# EAGLE design Aeolus_SMA_inc_sensor (EAGLE 7.7.0)
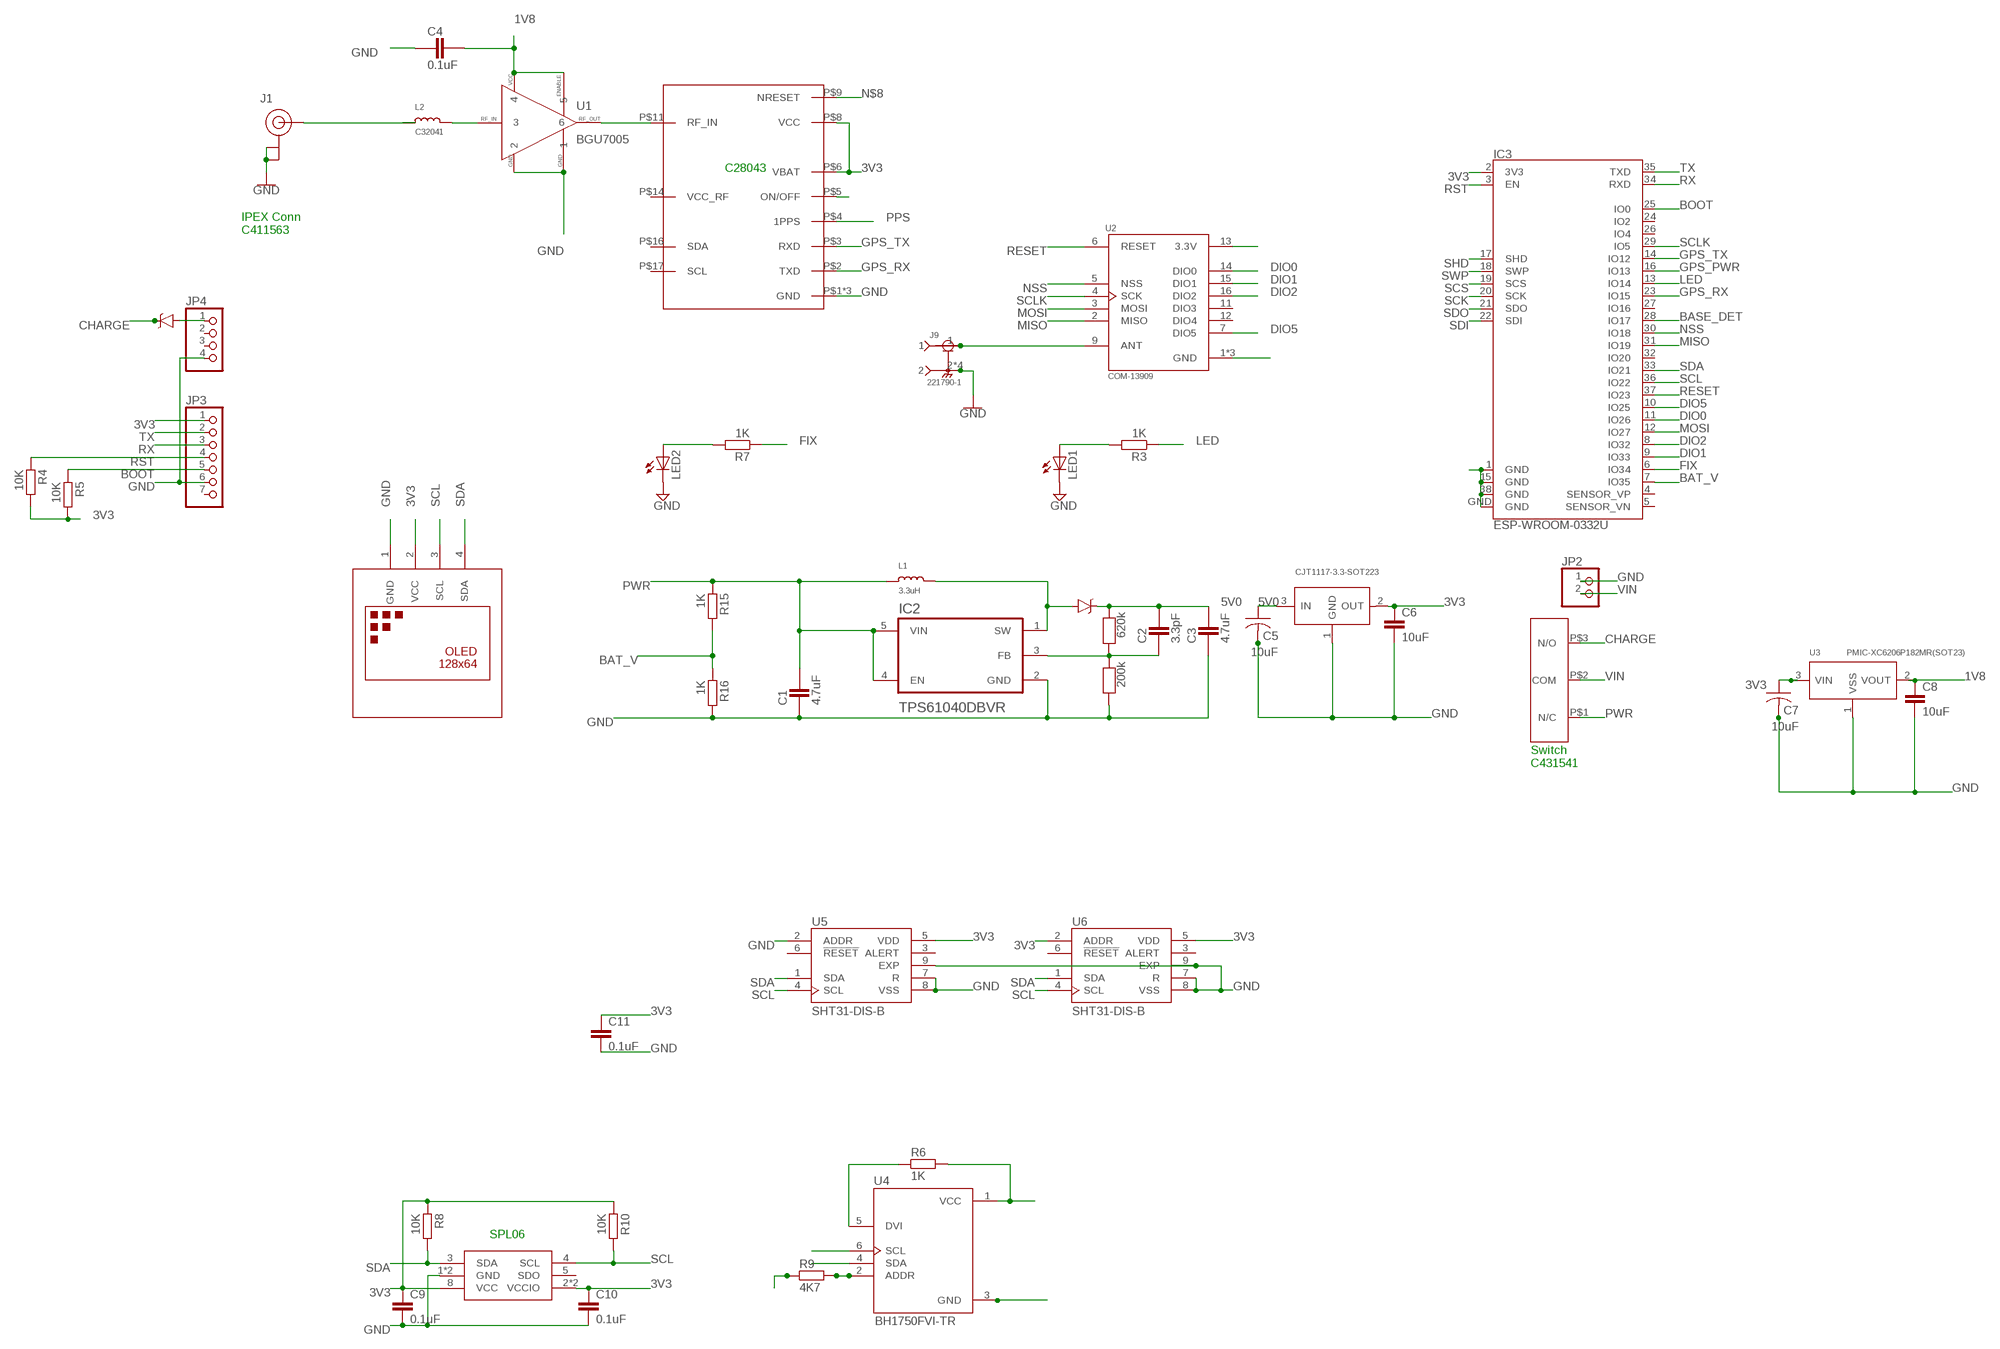
[diagram p0: schematic, sheet 1]

## Parts
C1  4.7uF  CAPACITOR_0603  [CAPC1608X92N]
C2  3.3pF  CAPACITOR_0402  [CAPC1005X60N]
C3  4.7uF  CAPACITOR_0603  [CAPC1608X92N]
C4  0.1uF  CAPACITOR_0603  [CAPC1608X92N]
C5  10uF  C-USC0805  [C0805]
C6  10uF  C-EUC0805  [C0805@1]
C7  10uF  C-USC0402  [C0402]
C8  10uF  C-EUC0402K  [C0402K@1]
C9  0.1uF  C-EUC0603  [C0603@1]
C10  0.1uF  C-EUC0603  [C0603@1]
C11  0.1uF  C-EUC0603  [C0603@1]
D1  BA340A  B340A  [SMA-DIODE]
D2  BA340A  B340A  [SMA-DIODE]
IC1  CJT1117-3.3-SOT223  PMIC-CJT1117-3.3(SOT223)  [SOT-223]
IC2  TPS61040DBVR  [SOT95P280X145-5N]
IC3  ESP-WROOM-0332U  [ESP32-WROOM-32U]
IC54  ATGM336H  [ATGM336H]
J1  U.FL  [U.FL]
J9  221790-1  [TE_221790-1]
JP2  HEADER-1X2ROUND  [1X02_ROUND]
JP3  HEADER-1X7ROUND  [1X07_ROUND]
JP4  HEADER-1X4ROUND  [1X04_ROUND]
L1  3.3uH  INDUCTORNR5040  [INDUCTOR_5X5MM_NR5040_NOTHERMALS]
L2  C32041  INDUCTOR_0402  [_0402]
LED1  LEDSML0805  [SML0805]
LED2  LEDSML0805  [SML0805]
R1  620k  RESISTOR0603  [0603]
R2  200k  RESISTOR0603  [0603]
R3  1K  RESISTOR_0603  [RESC1608X55N]
R4  10K  RESISTOR_0603  [RESC1608X55N]
R5  10K  RESISTOR_0603  [RESC1608X55N]
R6  1K  RESISTOR_0603  [RESC1608X55N]
R7  1K  RESISTOR_0603  [RESC1608X55N]
R8  10K  RESISTOR_0603  [RESC1608X55N]
R9  4K7  RESISTOR_0603  [RESC1608X55N]
R10  10K  RESISTOR_0603  [RESC1608X55N]
R15  1K  RESISTOR_0603  [RESC1608X55N]
R16  1K  RESISTOR_0603  [RESC1608X55N]
S1  SMD-SWITCH  [SMD-SWITCH]
U1  BGU7005  [SOT886]
U2  COM-13909  [MOD_COM-13909]
U3  PMIC-XC6206P182MR(SOT23)  [SOT-23]
U4  BH1750FVI-TR  [XDCR_BH1750FVI-TR]
U5  SHT31-DIS-B  [SON50P250X250X100-9N]
U6  SHT31-DIS-B  [SON50P250X250X100-9N]
U$1  DISPLAY-OLED-128X64-I2C  [DISPLAY-OLED-128X64-I2C]
U$4  SPL06  [SPL06]

## Nets
1V8: C4.2 C8.1 U1.4 U1.5 U3.2(VOUT)
3V3: C6.1 C7.1 C9.1 C10.1 C11.1 IC1.2(OUT) IC3.2(3V3) IC54.P$6(VBAT) IC54.P$8(VCC) JP3.1 R4.2 R5.2 R6.2 R8.1 R10.1 U2.13(3.3V) U3.3(VIN) U4.1(VCC) U5.5(VDD) U6.2(ADDR) U6.5(VDD) U$1.2(VCC) U$4.2(VCCIO) U$4.6(VCCIO) U$4.8(VCC)
5V0: C2.2 C3.2 C5.1 D1.C IC1.3(IN) R1.1
ANT: J9.1 U2.9(ANT)
BASE_DET: IC3.28(IO17)
BAT_V: IC3.7(IO35) R15.2 R16.1
BOOT: IC3.25(IO0) JP3.5 R5.1
CHARGE: D2.C S1.P$3(N/O)
DIO0: IC3.11(IO26) U2.14(DIO0)
DIO1: IC3.9(IO33) U2.15(DIO1)
DIO2: IC3.8(IO32) U2.16(DIO2)
DIO5: IC3.10(IO25) U2.7(DIO5)
FB: C2.1 IC2.3(FB) R1.2 R2.1
FIX: IC3.6(IO34) R7.1
GND: C1.1 C3.1 C4.1 C5.2 C6.2 C7.2 C8.2 C9.2 C10.2 C11.2 IC1.1(GND) IC2.2(GND) IC3.1(GND) IC3.15(GND) IC3.38(GND) IC3.GND IC54.P$1(GND) IC54.P$10(GND) IC54.P$12(GND) J1.1(GND) J1.2(GND) J9.2 J9.3 J9.4 J9.5 JP2.1 JP3.6 JP4.4 LED1.C LED2.C R2.2 R9.1 R16.2 U1.1 U1.2 U2.1(GND) U2.8(GND) U2.10(GND) U3.1(VSS) U4.3(GND) U5.2(ADDR) U5.7(R) U5.8(VSS) U5.9(EXP) U6.7(R) U6.8(VSS) U6.9(EXP) U$1.1(GND) U$4.1(GND) U$4.7(GND)
GPS_PWR: IC3.16(IO13)
GPS_RX: IC3.23(IO15) IC54.P$2(TXD)
GPS_TX: IC3.14(IO12) IC54.P$3(RXD)
LED: IC3.13(IO14) R3.1
MISO: IC3.31(IO19) U2.2(MISO)
MOSI: IC3.12(IO27) U2.3(MOSI)
N$1: D1.A IC2.1(SW) L1.P$2
N$2: D2.A JP4.1
N$3: LED1.A R3.2
N$4: J1.FEED(SIGNAL) L2.1
N$5: LED2.A R7.2
N$6: IC54.P$11(RF_IN) U1.6
N$7: R6.1 U4.5(DVI)
N$8: IC54.P$9(NRESET)
N$9: IC54.P$5(ON/OFF)
N$11: L2.2 U1.3
N$12: R9.2 U4.2(ADDR)
NSS: IC3.30(IO18) U2.5(NSS)
PPS: IC54.P$4(1PPS)
PWR: C1.2 IC2.4(EN) IC2.5(VIN) L1.P$1 R15.1 S1.P$1(N/C)
RESET: IC3.37(IO23) U2.6(RESET)
RST: IC3.3(EN) JP3.4 R4.1
RX: IC3.34(RXD) JP3.3
SCK: IC3.20(SCK)
SCL: IC3.36(IO22) R10.2 U4.6(SCL) U5.4(SCL) U6.4(SCL) U$1.3(SCL) U$4.4(SCL)
SCLK: IC3.29(IO5) U2.4(SCK)
SCS: IC3.19(SCS)
SDA: IC3.33(IO21) R8.2 U4.4(SDA) U5.1(SDA) U6.1(SDA) U$1.4(SDA) U$4.3(SDA)
SDI: IC3.22(SDI)
SDO: IC3.21(SDO)
SHD: IC3.17(SHD)
SWP: IC3.18(SWP)
TX: IC3.35(TXD) JP3.2
VIN: JP2.2 S1.P$2(COM)
Unconnected: IC3.4(SENSOR_VP) IC3.5(SENSOR_VN) IC3.24(IO2) IC3.26(IO4) IC3.27(IO16) IC3.32(IO20) IC54.P$14(VCC_RF) IC54.P$16(SDA) IC54.P$17(SCL) JP3.7 JP4.2 JP4.3 U2.11(DIO3) U2.12(DIO4) U5.3(ALERT) U5.6(!RESET) U6.3(ALERT) U6.6(!RESET) U$4.5(SDO)

## Notes on the sheet
- C28043
- IPEX Conn
  C411563
- Switch
  C431541
- SPL06

## Library data of the parts
C1-C4 = ipc-7351-capacitor:CAPACITOR_
C5 C7 = resistor:C-US: CAPACITOR, American symbol
C6 C8-C11 = resistor:C-EU: CAPACITOR, European symbol
D1 D2 = SparkFun-DiscreteSemi (Jaret’s MacBook Pro's conflicted copy 2016-01-31):B340A: Schottky Diode 3A-40V; PROD_ID: DIO-09886
IC1 = Seeed-IC:PMIC-CJT1117-3.3(SOT223): 310030097; MPN: CJT1117-3.3
IC2 = TPS61040DBVR:TPS61040DBVR: Check prices <https://snapeda.com/parts/TPS61040DBVR/Texas%20Instruments/view-part/?ref=eda>; AVAILABILITY: Good; DESCRIPTION: 28-V, 400-mA Switch Boost Converter in SOT-23 for LCD and White LED Applications 5-SOT-23 -40 to 85; DIGIKEY-PURCHASE-URL: https://snapeda.com/shop?store=DigiKey&id=218715; MF: Texas Instruments; MOUSER-PURCHASE-URL: https://snapeda.com/shop?store=Mouser&id=218715; MP: TPS61040DBVR; PACKAGE: SOT-23-5 Texas Instruments; PRICE: None; TEXAS_INSTRUMENTS-PURCHASE-URL: https://snapeda.com/shop?store=Texas+Instruments&id=218715
IC3 = esp32:ESP-WROOM-03
IC54 = microbuilder:ATGM336H
J1 = SparkFun-Connectors:U.FL: SMD Antenna Connector - U.FL 2mm height, 3.0mm x 3.0mm receptacle size. SparkFun Products: SparkFun WiFi Shield - ESP8266 <https://www.sparkfun.com/products/13287> SparkFun ESP8266 Thing <https://www.sparkfun.com/products/13231> SparkFun MiniGen - Pro Mini Signal Generator Shield <https://www.sparkfun.com/products/11420>; PROD_ID: CONN-09193; SF_ID: WRL-09144
J9 = 221790-1:221790-1: Connector; SMA; PCB; Right Angle; Stainless Steel; 0.6 in.; Beryllium Copper Check prices <https://pricing.snapeda.com/parts/221790-1/TE%20Connectivity/view-part?ref=eda>; AVAILABILITY: In Stock; COMMENT: 221790-1; DESCRIPTION: Connector; SMA; PCB; Right Angle; Stainless Steel; 0.6 in.; Beryllium Copper; MF: TE Connectivity; MP: 221790-1; PACKAGE: None; PRICE: None; PURCHASE-URL: https://pricing.snapeda.com/search/part/221790-1/?ref=eda
JP2 = microbuilder:HEADER-1X2: PIN HEADER
JP3 = microbuilder:HEADER-1X7: PIN HEADER
JP4 = microbuilder:HEADER-1X4: PIN HEADER
L1 L2 = microbuilder:INDUCTOR: Inductors 0603: 10nH Ceramic Inductor - microwire antenna/RF (Digikey: 712-1434-2-ND) 0805: 560nH Ceramic Inductor - RF (Digikey: 553-1047-1-ND) 270nH Ceramic Inductor - Q = 40@250MHz, +-5%, 1 Ohm DC Resistance (Digikey: 535-10506-2-ND) 1007 (2518 Metric) SMT: 10µH 10% 250mOhm 820mA 1007 Inductor (Digikey: 587-2189-1-ND) 22µH 10% 500mOhm 580mA 1007 Inductor (Digikey: 587-2190-1-ND) 47µH 10% 950mOhm 420mA 1007 Inductor (Digikey: 587-2191-1-ND) 47µH 5% 100mOhm 1A 1008 Inductor (Digikey: 732-1816-1-ND) 5.0x5.0mm (Taiyo Yuden NR5040 Series) 6.8µH 20% 2.3A 64mOhm Inductor (Digikey: 587-2374-2-ND) 5.0x5.0mm (TDK VLC5045 Series) 4.7µH 20% 3.3A 34mOhm Inductor (Digikey: 445-6526-1-ND) 6.8µH 20% 2.7A 46mOhm Inductor (Digikey: 445-6527-1-ND) 6.0x6.0mm (TDK VLC6045 Series) 4.7µH 20% 3.8A 27mOhm Inductor (Digikey: 445-6538-2-ND) 6.8µH 20% 3A 41mOhm Inductor (Digikey: 445-6540-1-ND) 6.2µH 30% 2.2A 45mOhm Inductor (Digikey: SRR5028-6R2YCT-ND) - Not TDK VLC6045 but footprint should match 6.0x6.0mm (TDK SLF6045 Series) 6.8uH 30% 2A 33mOhm Inductor (Digikey: 445-4572-1-ND, Mouser: 810-SLF645T6R8N2R0PF)
LED1 LED2 = led:LED: LED OSRAM: - CHIPLED LG R971, LG N971, LY N971, LG Q971, LY Q971, LO R971, LY R971 LH N974, LH R974 LS Q976, LO Q976, LY Q976 LO Q996 - Hyper CHIPLED LW Q18S LB Q993, LB Q99A, LB R99A - SideLED LS A670, LO A670, LY A670, LG A670, LP A670 LB A673, LV A673, LT A673, LW A673 LH A674 LY A675 LS A676, LA A676, LO A676, LY A676, LW A676 LS A679, LY A679, LG A679 - Hyper Micro SIDELED® LS Y876, LA Y876, LO Y876, LY Y876 LT Y87S - SmartLED LW L88C, LW L88S LB L89C, LB L89S, LG L890 LS L89K, LO L89K, LY L89K LS L896, LA L896, LO L896, LY L896 - TOPLED LS T670, LO T670, LY T670, LG T670, LP T670 LSG T670, LSP T670, LSY T670, LOP T670, LYG T670 LG T671, LOG T671, LSG T671 LB T673, LV T673, LT T673, LW T673 LH T674 LS T676, LA T676, LO T676, LY T676, LB T676, LH T676, LSB T676, LW T676 LB T67C, LV T67C, LT T67C, LS T67K, LO T67K, LY T67K, LW E67C LS E67B, LA E67B, LO E67B, LY E67B, LB E67C, LV E67C, LT E67C LW T67C LS T679, LY T679, LG T679 LS T770, LO T770, LY T770, LG T770, LP T770 LB T773, LV T773, LT T773, LW T773 LH T774 LS E675, LA E675, LY E675, LS T675 LS T776, LA T776, LO T776, LY T776, LB T776 LHGB T686 LT T68C, LB T68C - Hyper Mini TOPLED® LB M676 - Mini TOPLED Santana® LG M470 LS M47K, LO M47K, LY M47K Source: http://www.osram.convergy.de LUXEON: - LUMILED® LXK2-PW12-R00, LXK2-PW12-S00, LXK2-PW14-U00, LXK2-PW14-V00 LXK2-PM12-R00, LXK2-PM12-S00, LXK2-PM14-U00 LXK2-PE12-Q00, LXK2-PE12-R00, LXK2-PE12-S00, LXK2-PE14-T00, LXK2-PE14-U00 LXK2-PB12-K00, LXK2-PB12-L00, LXK2-PB12-M00, LXK2-PB14-N00, LXK2-PB14-P00, LXK2-PB14-Q00 LXK2-PR12-L00, LXK2-PR12-M00, LXK2-PR14-Q00, LXK2-PR14-R00 LXK2-PD12-Q00, LXK2-PD12-R00, LXK2-PD12-S00 LXK2-PH12-R00, LXK2-PH12-S00 LXK2-PL12-P00, LXK2-PL12-Q00, LXK2-PL12-R00 Source: www.luxeon.com KINGBRIGHT: KA-3528ASYC Source: www.kingbright.com
R1 R2 = microbuilder:RESISTOR: Resistors 0402 - 0402 Surface Mount Package 22 Ohm 1% 1/16W [Digikey: 311-22.0LRTR-ND] 33 Ohm 5% 1/16W 1.0K 5% 1/16W 1.5K 5% 1/16W 2.0K 1% 1/16W 10.0K 1% 1/16W [Digikey: 311-10.0KLRTR-ND] 10.0K 5% 1/16W [Digikey: RMCF0402JT10K0TR-ND] 12.1K 1% 1/16W [Digikey: 311-22.0LRTR-ND] 100.0K 5% 1/16W 0603 - 0603 Surface Mount Package 0 Ohm 1/10 Watt 1% Resistor 15 Ohm 1/10 Watt 1% Resistor 33 Ohm 1/10 Watt 1% Resistor 49.9 Ohm 1/10 Watt 1% Resistor 100 Ohm 1/10 Watt 1% Resistor 150 Ohm 1/10 Watt 1% Resistor 240 Ohm 1/10 Watt 1% Resistor 390 Ohm 1/10 Watt 1% Resistor 560 Ohm 1/10 Watt 1% Resistor 680 Ohm 1/10 Watt 1% Resistor 750 Ohm 1/10 Watt 1% Resistor 1.0K Ohm 1/10 Watt 1% Resistor 1.5K Ohm 1/10 Watt 1% Resistor 2.0K Ohm 1/10 Watt 1% Resistor 2.2K Ohm 1/10 Watt 1% Resistor 3.3K Ohm 1/10 Watt 1% Resistor 4.7K Ohm 1/10 Watt 1% Resistor 10.0K Ohm 1/10 Watt 1% Resistor 12.0K Ohm 1/10 Watt 1% Resistor 12.1K Ohm 1/10 Watt 1% Resistor 20.0K Ohm 1/10 Watt 1% Resistor 33.0K Ohm 1/10 Watt 1% Resistor 100.0K Ohm 1/10 Watt 1% Resistor 0805 - 0805 Surface Mount Package 0 Ohm 1/8 Watt 1% Resistor 33 Ohm 1/8 Watt 1% Resistor 100 Ohm 1/8 Watt 1% Resistor 150 Ohm 1/8 Watt 1% Resistor 200 Ohm 1/8 Watt 1% Resistor 240 Ohm 1/8 Watt 1% Resistor 330 Ohm 1/8 Watt 1% Resistor 390 Ohm 1/8 Watt 1% Resistor 470 Ohm 1/8 Watt 1% Resistor 1.0K Ohm 1/8 Watt 1% Resistor 1.5K Ohm 1/8 Watt 1% Resistor 2.0K Ohm 1/8 Watt 1% Resistor 4.7K Ohm 1/8 Watt 1% Resistor 5.1K Ohm 1/8 Watt 1% Resistor 5.6K Ohm 1/8 Watt 1% Resistor 10.0K Ohm 1/8 Watt 1% Resistor 22.0K Ohm 1/8 Watt 1% Resistor 33.0K Ohm 1/8 Watt 1% Resistor 100K Ohm 1/8 Watt 1% Resistor 1206 - 1206 Surface Mount Package 2012 - 2010 Surface Mount Package 0.11 Ohm 1/2 Watt 1% Resistor - Digikey: RHM.11UCT-ND
R3-R10 R15 R16 = ipc-7351-resistor:RESISTOR_
S1 = pinhead:SMD-SWITCH
U1 = BGU7005:BGU7005: Check prices <https://pricing.snapeda.com/parts/BGU7005/NXP%20USA/view-part?ref=eda>; AVAILABILITY: Not in stock; DESCRIPTION: RF Amplifier IC GPS 850MHz, 1.9GHz 6-XSON, SOT886 (1.45x1); MF: NXP USA; MP: BGU7005; PACKAGE: XFDFN-6 NXP Semiconductors; PRICE: None
U2 = COM-13909:COM-13909: Rfm69hcw Wireless Transceiver 91; AVAILABILITY: Unavailable; DESCRIPTION: General ISM < 1GHz Transceiver Module 915MHz Surface Mount; MF: HOPERF; MP: RFM69HCW-315S2; PACKAGE: Module SparkFun Electronics; PRICE: None
U3 = PMIC-XC6206P182MR_SOT23_:PMIC-XC6206P182MR(SOT23): 310030016 Check prices <https://pricing.snapeda.com/parts/XC6206P182MR/Torex/view-part?ref=eda>; AVAILABILITY: In Stock; DESCRIPTION: Linear Voltage Regulator IC Positive Fixed 1 Output 80mA SOT-23; MF: Torex; MP: XC6206P182MR; PACKAGE: SOT-23-3 Torex; PRICE: None; PURCHASE-URL: https://pricing.snapeda.com/search/part/XC6206P182MR/?ref=eda
U4 = BH1750FVI-TR:BH1750FVI-TR: Light to Digital Ambient Light Sensor Digital O/P 1lux to 65535lux 6-Pin WSOF Embossed T/R Check prices <https://pricing.snapeda.com/parts/BH1750FVI-TR/ROHM%20Semiconductor/view-part?ref=eda>; AVAILABILITY: In Stock; DESCRIPTION: Light to Digital Ambient Light Sensor Digital 3V 6-Pin WSOF T/R; MF: ROHM Semiconductor; MP: BH1750FVI-TR; PACKAGE: SMD-6 ROHM Semiconductor; PRICE: None; PURCHASE-URL: https://pricing.snapeda.com/search/part/BH1750FVI-TR/?ref=eda
U5 U6 = SHT31-DIS-B:SHT31-DIS-B: SHT31 Series 5.5 V 800 µA Surface Mount Humidity and Temperature Sensor Check prices <https://pricing.snapeda.com/parts/SHT31-DIS-B/Sensirion%20AG/view-part?ref=eda>; AVAILABILITY: In Stock; DESCRIPTION: Humidity Temperature Sensor 0 ~ 100% RH I²C ±2% RH 8s Surface Mount; MF: Sensirion AG; MP: SHT31-DIS-B; PACKAGE: TDFN-8 Sensirion; PRICE: None; PURCHASE-URL: https://pricing.snapeda.com/search/part/SHT31-DIS-B/?ref=eda
U$1 = diy-modules:DISPLAY-OLED-128X64-I2C
U$4 = SHT21D:SPL06

## Net classes
0 default: width 0.254 mm, drill 0.305 mm, clearance 0.152 mm

## Board
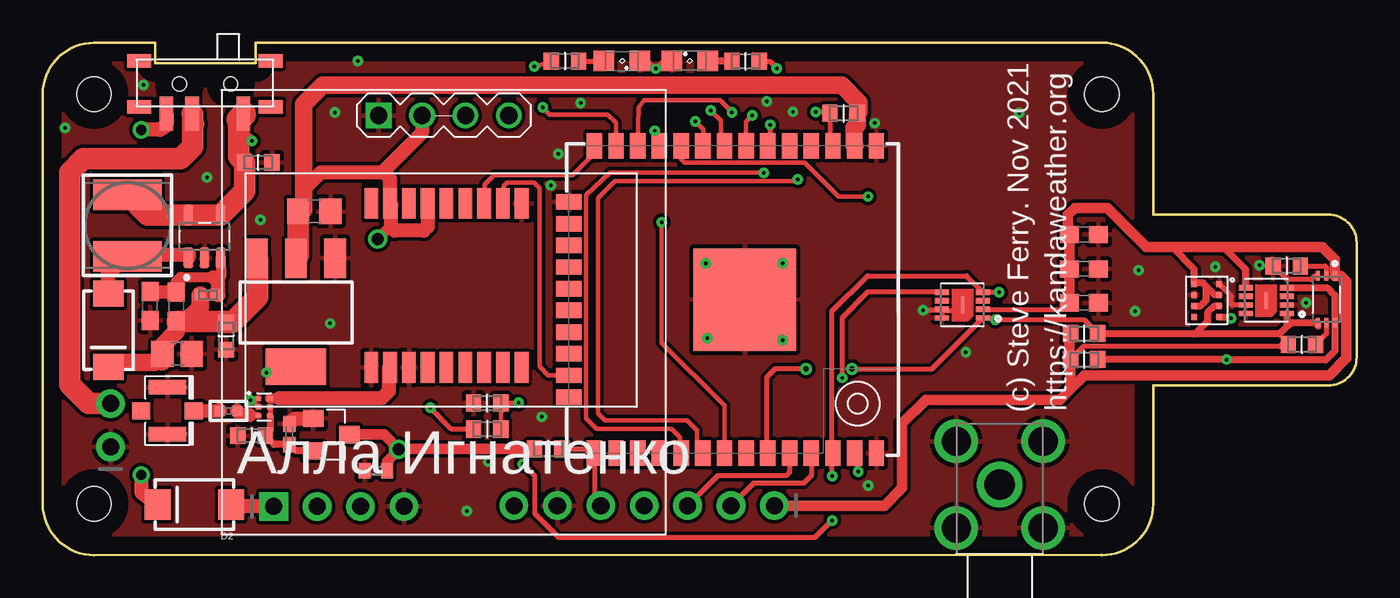
[diagram p1: board, top side]
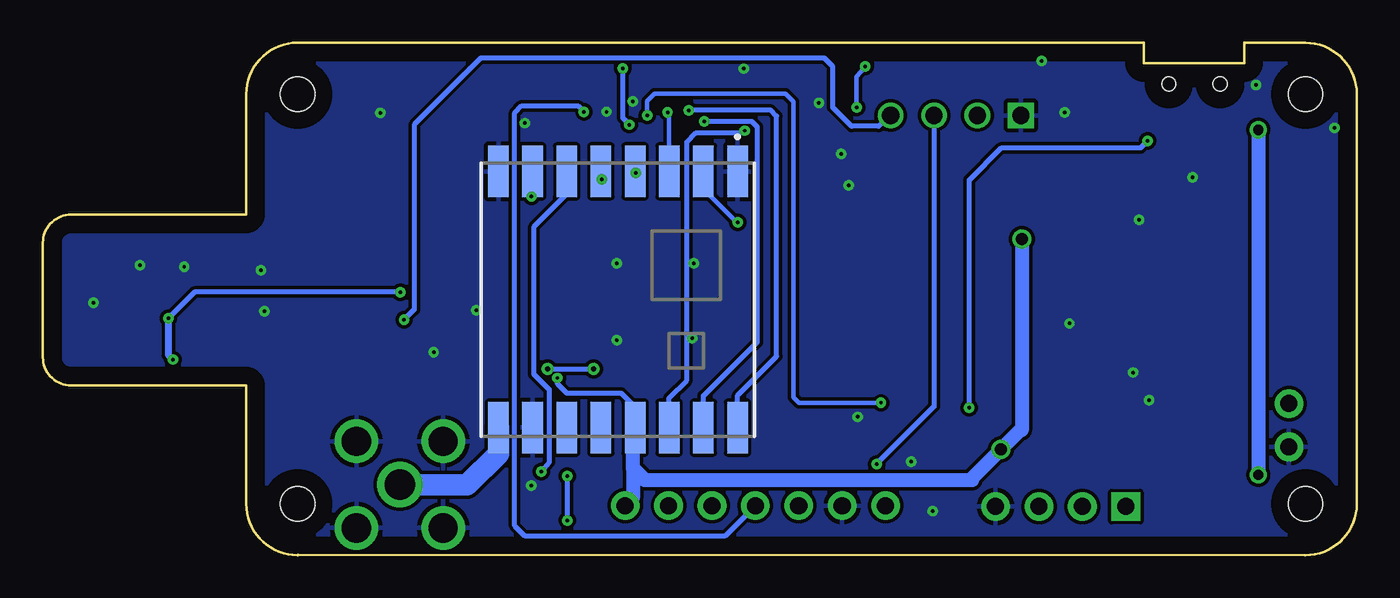
[diagram p2: board, bottom side, seen from below]

Size 76.9 x 30.01 mm. Coordinates in mm from the lower left corner, seen from the top.
Outline: 62,0 arc90 65,3
Outline: 65,27 arc90 61.99,30.01
Outline: 61.98,30.01 12.47,30.01 12.47,28.81 6.57,28.81 6.57,30 3,30 arc90 0,27 0,3 arc90 3,0 61.97,0.01
Outline: 65,2.94 65,9.94 75.25,9.94 arc90 76.9,11.58 76.9,18.3 arc90 75.25,19.94 65,19.94 65,27.04
Copper layers (1*16): Top 0.035mm / dielectric 1.5mm / Bottom 0.035mm
Design rules "default": minimum track width 10mil, minimum drill 24mil, track to track 8mil, track to pad 8mil, pad to pad 8mil, via to via 8mil, smd to smd 8mil, copper to edge 40mil, drill to drill 8mil, minimum pad ring 10mil, minimum via ring 8mil, stop-mask expansion 4mil, vias tented up to drill 0mil, thermal gap 10mil
Holes 2 mm at 3,3 3,27 62,27 62,3

### Footprints (pad centres in the part's own frame; a part is rotated, then mirrored left to right if it is on the bottom)
CAPC1608X92N = smd 0.9 x 0.95: 1 -0.8,0; 2 0.8,0
CAPC1005X60N = smd 0.65 x 0.65: 1 -0.45,0; 2 0.45,0
C0805 = smd 1.3 x 1.5: 1 -0.85,0; 2 0.85,0
C0805@1 = smd 1.3 x 1.5: 1 -0.95,0; 2 0.95,0
C0402 = smd 0.7 x 0.9: 1 -0.65,0; 2 0.65,0
C0402K@1 = smd 0.925 x 0.74: 1 -0.6,0; 2 0.6,0
C0603@1 = smd 1.1 x 1: 1 -0.85,0; 2 0.85,0
SMA-DIODE = smd 1.524 x 1.778: A -2.15,0; C 2.15,0
SOT-223 = smd 1.27 x 2.286: 1 -2.286,-3.175; 2 0,-3.175; 3 2.286,-3.175 | smd 3.556 x 2.159: TER 0,3.175
SOT95P280X145-5N = smd 1.21 x 0.59: 1 -1.255,0.95; 2 -1.255,0; 3 -1.255,-0.95; 4 1.255,-0.95; 5 1.255,0.95
ESP32-WROOM-32U = smd 0.9 x 1.5: 1 7.954,9; 2 6.684,9; 3 5.414,9; 4 4.144,9; 5 2.874,9; 6 1.604,9; 7 0.334,9; 8 -0.936,9; 9 -2.206,9; 10 -3.476,9; 11 -4.746,9; 12 -6.016,9; 13 -7.286,9; 14 -8.556,9; 25 -8.556,-9; 26 -7.286,-9; 27 -6.016,-9; 28 -4.746,-9; 29 -3.476,-9; 30 -2.206,-9; 31 -0.936,-9; 32 0.334,-9; 33 1.604,-9; 34 2.874,-9; 35 4.144,-9; 36 5.414,-9; 37 6.684,-9; 38 7.954,-9 | smd 1.5 x 0.9: 15 -10.046,5.715; 16 -10.046,4.445; 17 -10.046,3.175; 18 -10.046,1.905; 19 -10.046,0.635; 20 -10.046,-0.635; 21 -10.046,-1.905; 22 -10.046,-3.175; 23 -10.046,-4.445; 24 -10.046,-5.715 | smd 6 x 6: GND 0.254,0
ATGM336H = smd 1.8 x 0.8: P$1 4.7,-4.5; P$2 4.7,-3.4; P$3 4.7,-2.3; P$4 4.7,-1.2; P$5 4.7,-0.1; P$6 4.7,1; P$7 4.7,2.1; P$8 4.7,3.2; P$9 4.7,4.3; P$10 -4.9,4.3; P$11 -4.9,3.2; P$12 -4.9,2.1; P$13 -4.9,1; P$14 -4.9,-0.1; P$15 -4.9,-1.2; P$16 -4.9,-2.3; P$17 -4.9,-3.4; P$18 -4.9,-4.5
U.FL = smd 2.2 x 0.85: 1 0,1.375; 2 0,-1.375 | smd 1.05 x 1: FEED 1.525,0; NC -1.525,0
TE_221790-1 = drill 1.778: 1 0,0 | drill 1.702: 2 -2.54,2.54; 3 2.54,2.54; 4 -2.54,-2.54; 5 2.54,-2.54
1X02_ROUND = drill 1 pad 1.676: 1 -1.27,0; 2 1.27,0
1X07_ROUND = drill 1 pad 1.676: 1 -7.62,0; 2 -5.08,0; 3 -2.54,0; 4 0,0; 5 2.54,0; 6 5.08,0; 7 7.62,0
1X04_ROUND = drill 1 pad 1.676 square: 1 -3.81,0 | drill 1 pad 1.676: 2 -1.27,0; 3 1.27,0; 4 3.81,0
INDUCTOR_5X5MM_NR5040_NOTHERMALS = smd 1.8 x 4: P$1 -1.8,0; P$2 1.8,0
_0402 = smd 0.6 x 0.6: 1 -0.508,0; 2 0.508,0
SML0805 = smd 1.2 x 1.2: A 1.05,0; C -1.05,0
0603 = smd 1.1 x 1: 1 -0.85,0; 2 0.85,0
RESC1608X55N = smd 0.9 x 1: 1 -0.8,0; 2 0.8,0
SMD-SWITCH = smd 0.8 x 2: P$1 -2.25,1.75; P$2 0.75,1.75; P$3 2.25,1.75 | smd 1.4 x 0.8: P$4 -3.85,-1.35; P$5 3.85,-1.35; P$6 3.85,1.35; P$7 -3.85,1.35 | hole 0.8: -1.5,0; 1.5,0
SOT886 = smd 0.325 x 0.27: 1 -0.338,0.5; 2 -0.338,0; 3 -0.338,-0.5; 4 0.338,-0.5; 5 0.338,0; 6 0.338,0.5
MOD_COM-13909 = smd 3 x 1.2: 1 -7.5,7; 2 -7.5,5; 3 -7.5,3; 4 -7.5,1; 5 -7.5,-1; 6 -7.5,-3; 7 -7.5,-5; 8 -7.5,-7; 9 7.5,-7; 10 7.5,-5; 11 7.5,-3; 12 7.5,-1; 13 7.5,1; 14 7.5,3; 15 7.5,5; 16 7.5,7
SOT-23 = smd 1.016 x 1.2: 1 -0.95,-1.06; 2 0.95,-1.06; 3 0,1.06
XDCR_BH1750FVI-TR = smd 0.55 x 0.25: 1 -1.375,0.5; 2 -1.375,0; 3 -1.375,-0.5; 4 1.375,-0.5; 5 1.375,0; 6 1.375,0.5
SON50P250X250X100-9N = smd 0.8 x 0.3: 1 -1.2,0.75; 2 -1.2,0.25; 3 -1.2,-0.25; 4 -1.2,-0.75; 5 1.2,-0.75; 6 1.2,-0.25; 7 1.2,0.25; 8 1.2,0.75 | smd 0.2 x 1: 9 0,0
DISPLAY-OLED-128X64-I2C = drill 1 square: 1 -4.08,9.99 | drill 1: 2 -1.54,9.99; 3 1,9.99; 4 3.54,9.99
SPL06 = smd 0.32 x 0.35: 1 0.73,0.97; 2 0.73,0.32; 3 0.73,-0.33; 4 0.73,-0.98; 5 -0.72,-0.98; 6 -0.72,-0.33; 7 -0.72,0.32; 8 -0.72,0.97

### Placement (x,y rotation side)
C1  12.62,23 180 top
C2  9.66,15.25 180 top
C3  10.73,12.84 90 top
C4  12.22,7 0 top
C5  7.86,11.79 0 top
C6  15.89,20.13 0 top
C7  19.5,4.95 180 top
C8  14.44,7.08 90 top
C9  60.94,18.77 0 top
C10  60.94,14.78 0 top
C11  60.94,16.76 0 top
D1  3.84,13.17 270 top
D2  8.87,2.96 180 top
IC1  14.82,14.21 180 top
IC2  9.47,18.67 90 top
IC3  40.84,14.97 0 top
IC54  23.53,15.9 90 top
J1  7.3,8.46 0 top
J9  56.01,4.13 270 top
JP2  3.97,7.61 90 top
JP3  35.2,2.9 180 top
JP4  17.33,2.85 0 top
L1  4.96,19.31 270 top
L2  10.87,8.45 0 top
LED1  33.9,28.93 180 top
LED2  37.88,28.95 0 top
R1  7.82,14.57 90 top
R2  6.28,14.59 270 top
R3  30.56,28.93 0 top
R4  46.87,25.88 0 top
R5  29.59,6.21 180 top
R6  73.7,12.34 180 top
R7  41.14,28.92 180 top
R8  60.95,12.98 0 top
R9  72.8,16.94 0 top
R10  60.95,11.46 0 top
R15  26.02,7.38 0 top
R16  26.02,8.91 180 top
S1  9.5,27.6 180 top
U1  12.96,8.68 0 top
U2  43.24,14.97 270 bottom
U3  16.89,7.06 270 top
U4  75.13,14.98 270 top
U5  71.61,14.91 180 top
U6  53.83,14.65 180 top
U$1  23.74,15.76 0 top
U$4  68.12,14.92 0 top

### Tracks (layer width: path | path; a pad name or v marks a point on that pad's centre or on a via)
1V8
  Top 0.305: U1.5 U1.4
  Top 0.406: U3.2 14.81,6.11 C8.1 13.54,6.48 C4.2 13.3,7.28 U1.4
3V3  (via drill 0.2, 0.7)
  Top 0.305: U6.2 59.71,14.4 C10.1 | U6.5 48.28,15.4 46.78,13.9 v46.78,10.39 v46.79,10.38 | R6.2 72.52,12.34 72.4,12.22 60.91,12.22 R10.1
  Top 0.406: U5.5 70.41,16.73 69.1,18.04 | U$4.2 68.6,15.24 68.1,15.74 | 68.1,15.74 67.9,15.94 67.45,15.94 U$4.8 67.4,16.74 66.1,18.04 | U$4.6 67.75,14.59 68.1,14.94 68.1,15.74
  Top 0.61: v19.61,18.51 v19.6,18.51 20.4,19.31 | U3.3 19.97,7.06 v20.84,6.19 | C7.1 20.15,5.5 v20.84,6.19 | R5.2 20.86,6.22 v20.84,6.19 | C9.1 | C9.1 C11.1 C10.1 | R8.1 60.09,13.04 60.09,11.52 R10.1 60.15,9.73 | 60.15,9.73 59.52,9.1 51.68,9.1 50.3,7.72 50.3,3.94 49.26,2.9 JP3.1 | C9.1 60,18.86 60,19.94 60.4,20.34 62.3,20.34 64.6,18.04 66.1,18.04 69.1,18.04 74.9,18.04 75.63,17.31 U4.1 75.98,16.36 76.3,16.04 76.3,11.54 75.3,10.54 60.96,10.54 60.15,9.73
  Top 0.813: IC54.P$6 22.53,19.23 22.3,19 20.6,19 20.4,19.2 20.4,19.31 20.4,20.53 IC54.P$8 20.33,22.05 19.97,22.41 19.87,22.41 | 19.87,22.41 16.27,22.41 15.27,21.41 | U$1.2 22.2,24.74 19.87,22.41
  Top 1.016: C6.1 15.19,20.13 15.27,20.21 15.27,21.41 15.27,26.41 16.37,27.51 46.77,27.51 47.77,26.51 47.77,25.97 R4.2 47.67,25.21 47.47,25.01 47.47,24.02 IC3.2
  Top 1.27: C6.1 14.94,17.51 IC1.2
  Bottom 0.305: v46.79,10.38 46.79,10.04 46.24,9.49 43.05,9.49 42.15,8.59 42.15,7.56 U2.13
  Bottom 0.813: 42.82,2.98 JP3.1 42.37,3.35 42.37,5.11 | 42.37,5.11 42.37,6.71 | 42.37,6.71 42.37,7.34 U2.13 42.24,6.84 42.37,6.71 | 42.37,5.11 41.67,4.41 22.52,4.41 22.52,4.51 v20.84,6.19 19.71,7.32 19.61,7.32 v19.61,18.51
5V0
  Top 0.813: 7.87,13.67 R1.1
  Top 1.016: R1.1 7.82,13.09 6.99,12.26 6.99,11.31 C5.1 6.51,11.29 4.11,11.29 D1.C | C2.2 9.21,14.51 8.37,13.67
  Top 1.27: 7.87,13.67 8.37,13.67 10.7,13.67 C3.2 11.1,13.64 12.57,15.11 12.57,17.35 IC1.3
ANT
  Bottom 1.27: U2.9 50.24,5.94 52.07,4.11 55.99,4.11 J9.1
BAT_V  (via drill 0.2)
  Top 0.254: R16.1 26.82,8.39 | 26.82,8.39 R15.2 | IC3.7 41.17,25.39 v41.53,25.75 | v27.85,8.92 27.35,8.92 26.82,8.39
  Bottom 0.254: v41.53,25.75 41.53,26.6 41.1,27.03 33.44,27.03 32.97,26.56 32.97,9.23 32.66,8.92 v27.85,8.92
BOOT
  Top 0.254: IC3.25 32.28,5.16
  Top 0.305: 31.98,5.92 IC3.25 | 31.88,6.12 IC3.25 | R5.1 31.78,6.22 IC3.25 | 32.28,5.16 32.28,3.28 JP3.5
CHARGE  (via drill 0.6)
  Top 0.813: S1.P$3 7.25,25.19 7.07,25.01 6.97,25.01 6.87,24.91 v5.77,24.91 | v5.77,4.71 5.77,3.66 D2.C
  Bottom 0.813: v5.77,24.91 v5.77,4.71
DIO0  (via drill 0.2)
  Top 0.254: IC3.11 35.85,24.82 v35.81,24.86
  Bottom 0.305: U2.14 40.24,9.21 39.21,10.24 39.21,24.19 38.66,24.74 35.93,24.74 v35.81,24.86
DIO1  (via drill 0.2)
  Top 0.254: IC3.9 38.68,24.92 v38.2,25.39
  Bottom 0.305: U2.15 38.24,9.33 35.09,12.48 35.09,25.07 35.41,25.39 v38.2,25.39
DIO2  (via drill 0.2)
  Top 0.254: 39.7,23.92 39.69,25.44 v39.09,26.04
  Top 0.305: 39.7,23.92 IC3.8
  Bottom 0.305: U2.16 36.24,9.35 33.95,11.64 33.95,25.72 34.28,26.05 v39.08,26.05 v39.09,26.04
DIO5  (via drill 0.2)
  Top 0.254: 37.37,23.95 37.37,23.19 37.57,22.99 44.57,23 46.57,21 v48.3,21
  Top 0.305: 37.37,23.95 IC3.10
  Bottom 0.254: U2.7 48.24,21.06 v48.3,21
FB
  Top 0.305: C2.1 10.28,15.25 10.27,15.22
  Top 0.61: R1.2 7.82,16.02 8.08,16.28 10,16.27 10.44,16.34 IC2.3
  Top 0.813: R2.1 R1.2 | 10.27,15.22 10.26,15.99 10,16.27
FIX  (via drill 0.2)
  Top 0.305: R7.1 42.56,28.92 v42.97,28.51 | v42.57,25.21 42.57,24.1 IC3.6
  Bottom 0.305: v42.97,28.51 42.97,25.61 v42.57,25.21
GND  (via drill 0.2)
  Top 0.254: LED1.C 35.44,28.93 v35.88,28.49 36.34,28.95 LED2.C
  Top 0.305: IC3.GND 40.84,15.46 | v12.16,9.09 12.21,9.09 U1.2 | U6.7 U6.8 | U5.7 69.61,14.66 69.57,14.7 69.57,15.17 U$4.1 | v51.53,14.35 52.59,14.35 52.6,14.34 53.52,14.34 U6.9 | U4.3 74.48,16.36 74.26,16.14 72.8,16.14 R9.1
  Top 0.406: v38.8,17.1 39.2,17.1 40.84,15.46
  Top 0.813: C8.2 14.75,8 U3.1
  Bottom 0.254: U2.10 48.24,6.56
  other vias: 13.1,10.7 17.1,25.93 18.45,28.93 16.82,13.57 26.08,5.47 29.2,8.1 29.73,21.66 30.18,23.49 12.75,19.65 54.03,11.88 57.14,25.9 9.6,22.13 1.3,25.03 5.9,27.53 43.3,17.1 43.3,12.6 38.9,12.7 48.69,25.3 43.91,25.97 42.37,26.58 31.48,26.48 24.83,2.59 48.31,4.07 63.93,14.28 64.13,16.68 68.63,16.88 73.93,14.78 71.23,16.98
  pour Top: 2.3,30 14.7,30 76.2,29.3 76.18,-0.21 0,0.1 0,27.6
  pour Bottom: 2.12,29.88 76.14,29.8 75.96,-0.24 0.2,0.1 0.21,27.94
GPS_RX
  Top 0.254: IC3.23 30.52,10.54 29.59,10.54 29.07,11.06 29.07,21.51 28.77,21.81 27.17,21.81 26.97,21.61 26.97,20.64 IC54.P$2
GPS_TX
  Top 0.254: IC3.14 32.04,23.96 32.04,23.28 31.01,22.25 26.41,22.25 25.87,21.71 25.87,20.64 IC54.P$3
LED  (via drill 0.2)
  Top 0.254: IC3.13 33.55,25.33 33.07,25.81 29.67,25.81 v29.27,26.21 | v28.77,28.61 29.74,28.91 R3.1
  Bottom 0.254: v29.27,26.21 29.27,28.01 v28.77,28.61
MISO  (via drill 0.2)
  Top 0.254: IC3.31 39.9,8.77 36.23,12.44 v36.23,19.49
  Bottom 0.254: v36.23,19.49 36.28,19.49 38.28,21.49 38.28,22.43 U2.2
MOSI  (via drill 0.2)
  Top 0.254: IC3.12 34.86,26.21 35.19,26.64 39.64,26.64 v40.34,25.94
  Bottom 0.254: U2.3 40.24,25.84 v40.34,25.94
N$1
  Top 0.813: IC2.1 8.57,17.61 6.99,17.61 5.64,17.6 L1.P$2 4.89,17.51 3.79,16.41 3.79,15.37 D1.A
N$2
  Top 0.813: 11.42,2.56 D2.A 11.13,2.85 JP4.1
N$3
  Top 0.305: R3.2 LED1.A
N$4
  Top 0.813: J1.FEED 10.33,8.48 L2.1
N$5
  Top 0.406: LED2.A 40.34,28.95 R7.2
N$6
  Top 0.406: 13.46,9.18 13.84,9.18 13.86,9.2
  Top 0.61: U1.6 13.46,9.18
  Top 0.813: 20.36,10.97 IC54.P$11 20.27,10.94 20.27,9.61 19.87,9.21 13.86,9.2
N$7
  Top 0.305: U4.5 75.13,12.97 R6.1
N$11
  Top 0.406: U1.3 12.09,8.19
  Top 0.813: 12.09,8.19 11.64,8.19 L2.2
N$12
  Top 0.305: R9.2 75.05,16.94 75.11,16.88 75.11,16.38 U4.2
NSS  (via drill 0.2)
  Top 0.254: 38.3,6.05 38.3,7.3 37.7,7.9 32.9,7.9 32.5,8.3 32.5,20.9 33.5,21.9 44.1,21.9 v44.2,22
  Top 0.305: 38.3,6.05 IC3.30
  Bottom 0.254: v44.2,22 44.3,22.41 U2.5
PWR  (via drill 0.2)
  Top 0.305: R15.1 23.94,7.38 v22.68,8.64 | v12.24,24.27 12.24,24.46 11.47,25.23
  Top 1.27: 11.47,25.51 11.47,25.23 11.47,23.35 C1.2 11.82,21.32 IC2.4 IC2.5 6.15,19.92 L1.P$1
  Top 1.422: 4.6,21.2 4.87,21.2 L1.P$1 | S1.P$1 11.75,25.79 11.47,25.51
  Bottom 0.305: v22.68,8.64 22.68,21.97 20.79,23.86 12.65,23.86 v12.24,24.27
RESET  (via drill 0.2)
  Top 0.305: v47.72,4.9 47.72,5.77 IC3.37
  Bottom 0.305: U2.6 46.24,21.14 48.17,19.21 48.17,10.61 47.27,9.71 47.27,5.45 v47.72,4.9
RST  (via drill 0.2)
  Top 0.305: IC3.3 46.07,24.15 R4.1 45.99,25.96 v45.23,25.96
  Bottom 0.305: 35.2,2.83 JP3.4 36.96,1.14 48.7,1.14 49.29,1.73 49.29,25.89 48.87,26.31 45.58,26.31 v45.23,25.96
RX
  Top 0.305: IC3.34 43.71,4.87 43.5,4.66 39.5,4.66 JP3.3
SCL  (via drill 0.2)
  Top 0.305: v55.98,15.4 U6.4 54.07,16.36 48.27,16.36 46.17,14.26 46.17,6.05 IC3.36 46.2,5.92 v46.2,4.64 | v28.1,5.34 28.8,4.64 28.8,2.44 30.2,1.04 45.2,1.04 v46.2,2.04
  Top 0.406: U5.4 72.83,15.64 75.2,15.64 75.63,15.21 U4.6 75.63,11.97 75.09,11.43 69.32,11.43 v69.29,11.46 R10.2 | U$4.4 69.49,13.94 v69.56,13.87
  Bottom 0.305: v55.98,15.4 68.03,15.4 v69.56,13.87 | U$1.3 24.74,8.7 v28.1,5.34 | v46.2,2.04 v46.2,4.64
  Bottom 0.406: v69.56,13.87 69.56,11.73 v69.29,11.46
SCLK  (via drill 0.2)
  Top 0.254: 37.3,6.16 37.3,6.9 36.8,7.4 32.4,7.4 31.8,8 31.8,21.1 33.2,22.4 v42.2,22.4
  Top 0.305: 37.3,6.16 IC3.29
  Bottom 0.254: v42.2,22.4 42.2,22.43 U2.4
SDA  (via drill 0.2, 0.3)
  Top 0.305: v44.67,10.91 42.87,10.91 42.37,10.41 42.37,6.04 IC3.33 | R8.2 60.94,13.79 v55.76,13.79 55.65,13.9 U6.1 52.04,10.91 v47.37,10.91
  Top 0.406: U5.1 72.81,13.38 | 72.81,13.38 72.38,12.95 67.43,12.95 | 67.43,12.95 61.78,12.95 R8.2 | U$4.3 68.56,14.59 68.17,14.2 68.17,13.69 67.43,12.95 | 74.63,13.4 U4.4 73.04,13.6 72.81,13.38
  Bottom 0.305: v47.37,10.91 v44.67,10.91 | U$1.4 27.33,25.75 27.97,25.11 29.57,25.11 30.67,26.21 30.67,28.61 31.17,29.11 51.27,29.11 55.17,25.21 55.17,14.38 v55.76,13.79
TX
  Top 0.305: IC3.35 44.98,4.66 44.53,4.21 41.59,4.21 JP3.2
VIN
  Top 1.016: S1.P$2 8.96,25.25
  Top 1.27: JP2.2 2.7,8.88 1.57,10.01 1.57,22.41 2.37,23.21 8.07,23.21 8.77,23.91 8.77,25.83 S1.P$2

### Text on the board
tPlace: Алла Игнатенко
112bmp: + | -
113bmp: + | -
_tsilk: (c) Steve Ferry. Nov 2021 | https://kandaweather.org
122bmp: CyBaart.eu | CyKanda Aeolus-pl Ver1.0 | https://kandaweather.org